# EAGLE design PC2CAN (EAGLE 6.6.0)

## Sheet 1 of 2: MCU
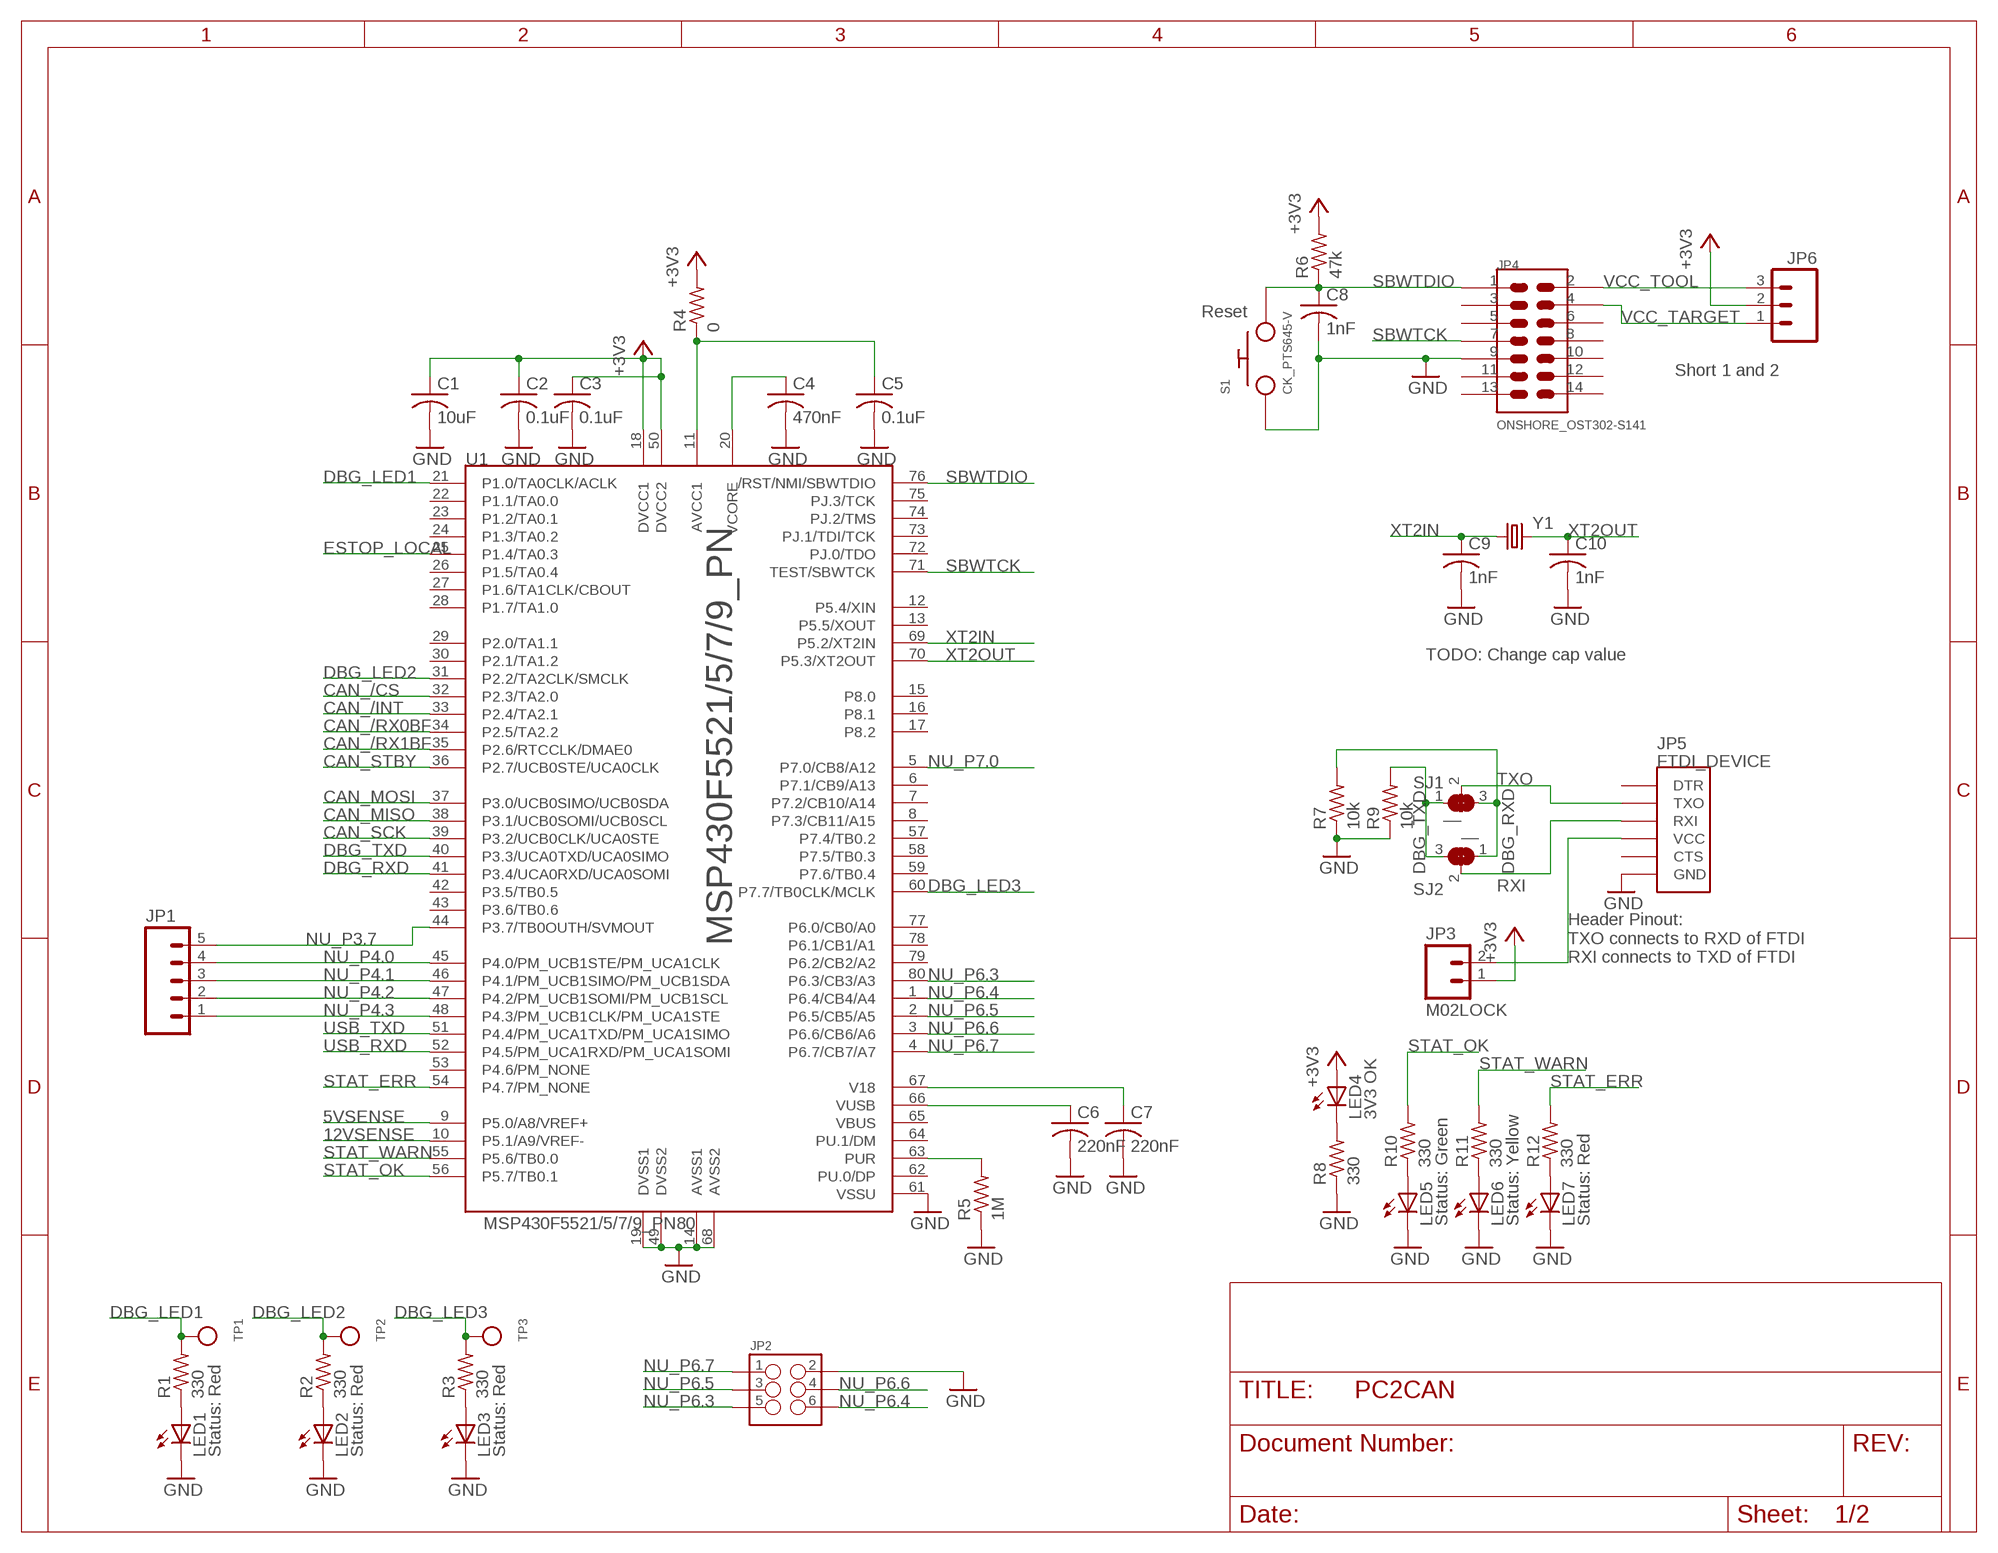
[diagram p0: schematic, sheet 1]

### Parts
C1  10uF  C-USC0805  [C0805]
C2  0.1uF  C-USC0603  [C0603]
C3  0.1uF  C-USC0603  [C0603]
C4  470nF  C-USC0603  [C0603]
C5  0.1uF  C-USC0603  [C0603]
C6  220nF  C-USC0603  [C0603]
C7  220nF  C-USC0603  [C0603]
C8  1nF  C-USC0603  [C0603]
C9  1nF  C-USC0603  [C0603]
C10  1nF  C-USC0603  [C0603]
JP1  M05PTH  [1X05]
JP2  M03X22X3_SILK_SM  [2X3]
JP3  M02LOCK  [1X02_LOCK]
JP4  ONSHORE_OST302-S141  [ONSHORE_OST302-S141]
JP5  FTDI_DEVICE  [FTDI_DEVICE_SIDE]
JP6  M03LOCK  [1X03_LOCK]
LED1  Status: Red  LED0603  [LED-0603]
LED2  Status: Red  LED0603  [LED-0603]
LED3  Status: Red  LED0603  [LED-0603]
LED4  3V3 OK  LED0603  [LED-0603]
LED5  Status: Green  LED0603  [LED-0603]
LED6  Status: Yellow  LED0603  [LED-0603]
LED7  Status: Red  LED0603  [LED-0603]
R1  330  R-US_R0603  [R0603]
R2  330  R-US_R0603  [R0603]
R3  330  R-US_R0603  [R0603]
R4  0  R-US_R0603  [R0603]
R5  1M  R-US_R0603  [R0603]
R6  47k  R-US_R0603  [R0603]
R7  10k  R-US_R0603  [R0603]
R8  330  R-US_R0603  [R0603]
R9  10k  R-US_R0603  [R0603]
R10  330  R-US_R0603  [R0603]
R11  330  R-US_R0603  [R0603]
R12  330  R-US_R0603  [R0603]
S1  CK_PTS645-V  [CK_PTS645-V]
SJ1  SOLDERJUMPER_2WAY0603  [SOLDERJUMPER_2WAY_OPEN_0603]
SJ2  SOLDERJUMPER_2WAY0603  [SOLDERJUMPER_2WAY_OPEN_0603]
TP1  TESTPOINT0.1"  [1X01_ROUND]
TP2  TESTPOINT0.1"  [1X01_ROUND]
TP3  TESTPOINT0.1"  [1X01_ROUND]
U1  MSP430F5521/5/7/9_PN80  [PN80]
Y1  CRYSTALHC49UV  [HC49U-V]

### Nets
5VSENSE: U1.9(P5.0/A8/VREF+) ; also sheet 2
12VSENSE: U1.10(P5.1/A9/VREF-) ; also sheet 2
+3V3: C1.1 C2.1 C3.1 JP3.1 JP6.2 LED4.A R4.2 R6.2 U1.18(DVCC1) U1.50(DVCC2) ; also sheet 2
AVCC: C5.1 R4.1 U1.11(AVCC1)
CAN_/CS: U1.32(P2.3/TA2.0) ; also sheet 2
CAN_/INT: U1.33(P2.4/TA2.1) ; also sheet 2
CAN_/RX0BF: U1.34(P2.5/TA2.2) ; also sheet 2
CAN_/RX1BF: U1.35(P2.6/RTCCLK/DMAE0) ; also sheet 2
CAN_MISO: U1.38(P3.1/UCB0SOMI/UCB0SCL) ; also sheet 2
CAN_MOSI: U1.37(P3.0/UCB0SIMO/UCB0SDA) ; also sheet 2
CAN_SCK: U1.39(P3.2/UCB0CLK/UCA0STE) ; also sheet 2
CAN_STBY: U1.36(P2.7/UCB0STE/UCA0CLK) ; also sheet 2
DBG_LED1: R1.2 TP1.1 U1.21(P1.0/TA0CLK/ACLK)
DBG_LED2: R2.2 TP2.1 U1.31(P2.2/TA2CLK/SMCLK)
DBG_LED3: R3.2 TP3.1 U1.60(P7.7/TB0CLK/MCLK)
DBG_RXD: R7.2 SJ1.3 SJ2.1 U1.41(P3.4/UCA0RXD/UCA0SOMI)
DBG_TXD: R9.2 SJ1.1 SJ2.3 U1.40(P3.3/UCA0TXD/UCA0SIMO)
ESTOP_LOCAL: U1.25(P1.4/TA0.3) ; also sheet 2
GND: C1.2 C2.2 C3.2 C4.2 C5.2 C6.2 C7.2 C8.2 C9.2 C10.2 JP2.2 JP4.9 JP5.P$6(GND) LED1.C LED2.C LED3.C LED5.C LED6.C LED7.C R5.1 R7.1 R8.1 R9.1 S1.1 U1.14(AVSS1) U1.19(DVSS1) U1.49(DVSS2) U1.61(VSSU) U1.68(AVSS2) ; also sheet 2
N$1: JP3.2 JP5.P$4(VCC)
N$2: LED4.C R8.2
N$3: LED5.A R10.1
N$4: LED6.A R11.1
N$5: LED7.A R12.1
N$6: LED1.A R1.1
N$7: R5.2 U1.63(PUR)
N$8: LED2.A R2.1
N$36: LED3.A R3.1
NU_P3.7: JP1.5 U1.44(P3.7/TB0OUTH/SVMOUT)
NU_P4.0: JP1.4 U1.45(P4.0/PM_UCB1STE/PM_UCA1CLK)
NU_P4.1: JP1.3 U1.46(P4.1/PM_UCB1SIMO/PM_UCB1SDA)
NU_P4.2: JP1.2 U1.47(P4.2/PM_UCB1SOMI/PM_UCB1SCL)
NU_P4.3: JP1.1 U1.48(P4.3/PM_UCB1CLK/PM_UCA1STE)
NU_P6.3: JP2.5 U1.80(P6.3/CB3/A3)
NU_P6.4: JP2.6 U1.1(P6.4/CB4/A4)
NU_P6.5: JP2.3 U1.2(P6.5/CB5/A5)
NU_P6.6: JP2.4 U1.3(P6.6/CB6/A6)
NU_P6.7: JP2.1 U1.4(P6.7/CB7/A7)
NU_P7.0: U1.5(P7.0/CB8/A12)
RXI: JP5.P$3(RXI) SJ2.2
SBWTCK: JP4.7 U1.71(TEST/SBWTCK)
SBWTDIO: C8.1 JP4.1 R6.1 S1.2 U1.76(/RST/NMI/SBWTDIO)
STAT_ERR: R12.2 U1.54(P4.7/PM_NONE)
STAT_OK: R10.2 U1.56(P5.7/TB0.1)
STAT_WARN: R11.2 U1.55(P5.6/TB0.0)
TXO: JP5.P$2(TXO) SJ1.2
USB_RXD: U1.52(P4.5/PM_UCA1RXD/PM_UCA1SOMI) ; also sheet 2
USB_TXD: U1.51(P4.4/PM_UCA1TXD/PM_UCA1SIMO) ; also sheet 2
V18: C7.1 U1.67(V18)
VCC_TARGET: JP4.4 JP6.1
VCC_TOOL: JP4.2 JP6.3
VCORE: C4.1 U1.20(VCORE)
VUSB: C6.1 U1.66(VUSB)
XT2IN: C9.1 U1.69(P5.2/XT2IN) Y1.1
XT2OUT: C10.1 U1.70(P5.3/XT2OUT) Y1.2
Unconnected: JP4.3 JP4.5 JP4.6 JP4.8 JP4.10 JP4.11 JP4.12 JP4.13 JP4.14 JP5.P$1(DTR) JP5.P$5(CTS) U1.6(P7.1/CB9/A13) U1.7(P7.2/CB10/A14) U1.8(P7.3/CB11/A15) U1.12(P5.4/XIN) U1.13(P5.5/XOUT) U1.15(P8.0) U1.16(P8.1) U1.17(P8.2) U1.22(P1.1/TA0.0) U1.23(P1.2/TA0.1) U1.24(P1.3/TA0.2) U1.26(P1.5/TA0.4) U1.27(P1.6/TA1CLK/CBOUT) U1.28(P1.7/TA1.0) U1.29(P2.0/TA1.1) U1.30(P2.1/TA1.2) U1.42(P3.5/TB0.5) U1.43(P3.6/TB0.6) U1.53(P4.6/PM_NONE) U1.57(P7.4/TB0.2) U1.58(P7.5/TB0.3) U1.59(P7.6/TB0.4) U1.62(PU.0/DP) U1.64(PU.1/DM) U1.65(VBUS) U1.72(PJ.0/TDO) U1.73(PJ.1/TDI/TCK) U1.74(PJ.2/TMS) U1.75(PJ.3/TCK) U1.77(P6.0/CB0/A0) U1.78(P6.1/CB1/A1) U1.79(P6.2/CB2/A2)

### Notes on the sheet
- Reset
- Short 1 and 2
- TODO: Change cap value
- Header Pinout:
  TXO connects to RXD of FTDI
  RXI connects to TXD of FTDI

## Sheet 2 of 2: External
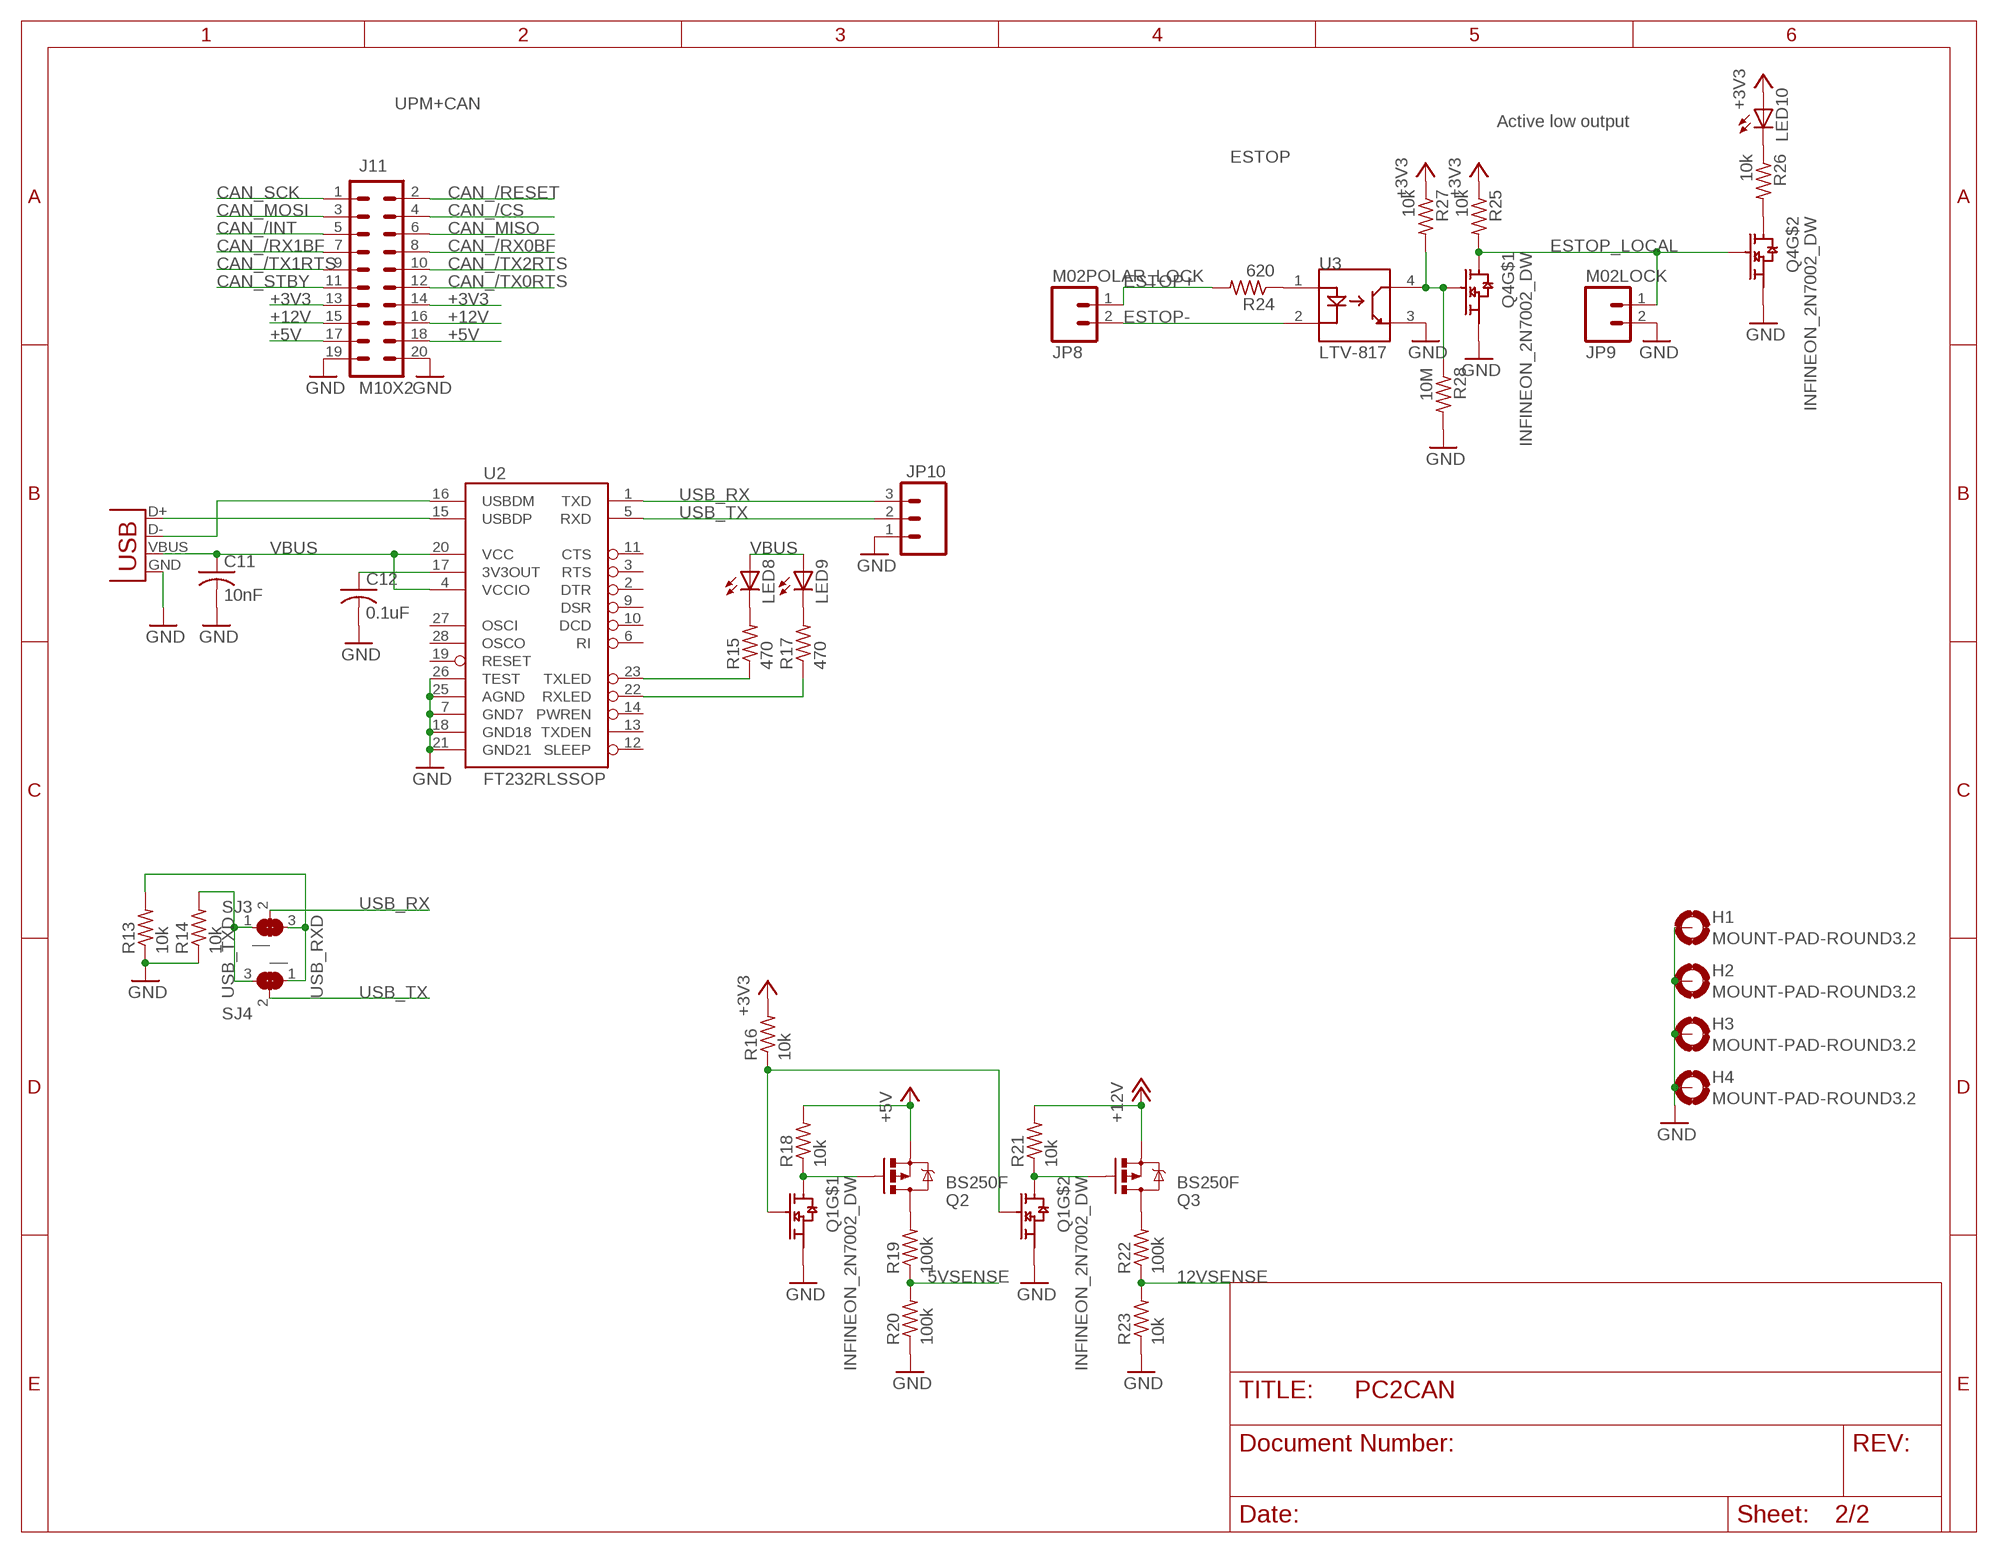
[diagram p1: schematic, sheet 2]

### Parts
C11  10nF  C-USC0603  [C0603]
C12  0.1uF  C-USC0603  [C0603]
H1  MOUNT-PAD-ROUND3.2  [3,2-PAD]
H2  MOUNT-PAD-ROUND3.2  [3,2-PAD]
H3  MOUNT-PAD-ROUND3.2  [3,2-PAD]
H4  MOUNT-PAD-ROUND3.2  [3,2-PAD]
J11  M10X2  [2X10]
JP7  USB-B  USBPTH  [USB-B-PTH]
JP8  M02POLAR_LOCK  [MOLEX-1X2_LOCK]
JP9  M02LOCK  [1X02_LOCK]
JP10  M03LOCK  [1X03_LOCK]
LED8  LED0603  [LED-0603]
LED9  LED0603  [LED-0603]
LED10  LED0603  [LED-0603]
Q1  INFINEON_2N7002_DW  [INFINEON_SOT363]
Q2  BS250F  MOSFET-PCHANNELSMD  [SOT23-3]
Q3  BS250F  MOSFET-PCHANNELSMD  [SOT23-3]
Q4  INFINEON_2N7002_DW  [INFINEON_SOT363]
R13  10k  R-US_R0603  [R0603]
R14  10k  R-US_R0603  [R0603]
R15  470  R-US_R0603  [R0603]
R16  10k  R-US_R0603  [R0603]
R17  470  R-US_R0603  [R0603]
R18  10k  R-US_R0603  [R0603]
R19  100k  R-US_R0603  [R0603]
R20  100k  R-US_R0603  [R0603]
R21  10k  R-US_R0603  [R0603]
R22  100k  R-US_R0603  [R0603]
R23  10k  R-US_R0603  [R0603]
R24  620  R-US_R0603  [R0603]
R25  10k  R-US_R0603  [R0603]
R26  10k  R-US_R0603  [R0603]
R27  10k  R-US_R0603  [R0603]
R28  10M  R-US_R0603  [R0603]
SJ3  SOLDERJUMPER_2WAY0603  [SOLDERJUMPER_2WAY_OPEN_0603]
SJ4  SOLDERJUMPER_2WAY0603  [SOLDERJUMPER_2WAY_OPEN_0603]
U2  FT232RLSSOP  [SSOP28DB]
U3  LTV-817  [LITEON_DIL04_.3]

### Nets
5VSENSE: R19.1 R20.2 ; also sheet 1
12VSENSE: R22.1 R23.2 ; also sheet 1
+3V3: J11.13 J11.14 LED10.A R16.2 R25.1 R27.1 ; also sheet 1
+5V: J11.17 J11.18 Q2.2(S) R18.2
+12V: J11.15 J11.16 Q3.2(S) R21.2
CAN_/CS: J11.4 ; also sheet 1
CAN_/INT: J11.5 ; also sheet 1
CAN_/RESET: J11.2
CAN_/RX0BF: J11.8 ; also sheet 1
CAN_/RX1BF: J11.7 ; also sheet 1
CAN_/TX0RTS: J11.12
CAN_/TX1RTS: J11.9
CAN_/TX2RTS: J11.10
CAN_MISO: J11.6 ; also sheet 1
CAN_MOSI: J11.3 ; also sheet 1
CAN_SCK: J11.1 ; also sheet 1
CAN_STBY: J11.11 ; also sheet 1
ESTOP+: JP8.1 R24.2
ESTOP-: JP8.2 U3.2
ESTOP_LOCAL: JP9.1 Q4.5(GATE) Q4.6(DRAIN) R25.2 ; also sheet 1
ESTOP_LOCAL_INV: Q4.2(GATE) R27.2 R28.1 U3.4
GND: C11.2 C12.2 H1.B3,2(MOUNT) H2.B3,2(MOUNT) H3.B3,2(MOUNT) H4.B3,2(MOUNT) J11.19 J11.20 JP7.GND JP9.2 JP10.1 Q1.1(SOURCE) Q1.4(SOURCE) Q4.1(SOURCE) Q4.4(SOURCE) R13.1 R14.1 R20.1 R23.1 R28.2 U2.7(GND7) U2.18(GND18) U2.21(GND21) U2.25(AGND) U2.26(TEST) U3.3 ; also sheet 1
N$9: Q2.3(D) R19.2
N$10: Q1.6(DRAIN) Q2.1(G) R18.1
N$11: Q3.3(D) R22.2
N$12: Q1.2(GATE) Q1.5(GATE) R16.1
N$13: R24.1 U3.1
N$14: JP7.D+ U2.15(USBDP)
N$15: JP7.D- U2.16(USBDM)
N$16: LED8.C R15.2
N$17: LED9.C R17.2
N$18: R15.1 U2.23(TXLED)
N$19: R17.1 U2.22(RXLED)
N$20: C12.1 U2.17(3V3OUT)
N$21: Q4.3(DRAIN) R26.2
N$22: LED10.C R26.1
USB_RX: JP10.3 SJ3.2 U2.1(TXD)
USB_RXD: R13.2 SJ3.3 SJ4.1 ; also sheet 1
USB_TX: JP10.2 SJ4.2 U2.5(RXD)
USB_TXD: R14.2 SJ3.1 SJ4.3 ; also sheet 1
VBUS: C11.1 JP7.VBUS LED8.A LED9.A U2.4(VCCIO) U2.20(VCC)
VTAP_EN: Q1.3(DRAIN) Q3.1(G) R21.1
Unconnected: U2.2(DTR) U2.3(RTS) U2.6(RI) U2.9(DSR) U2.10(DCD) U2.11(CTS) U2.12(SLEEP) U2.13(TXDEN) U2.14(PWREN) U2.19(RESET) U2.27(OSCI) U2.28(OSCO)

### Notes on the sheet
- UPM+CAN
- Active low output
- ESTOP

## Library data of the parts
C1-C12 = rcl:C-US: CAPACITOR, American symbol
H1-H4 = holes:MOUNT-PAD-ROUND: MOUNTING PAD, round
J11 = SparkFun-Connectors:M10X2: This was SPECIALLY designed to be used with our Graphic LCD Backpack. Be sure you want to use this! It is not only staggered on each line of header holes, but IT IS ALSO offset of the center point of the top and bottom lines by 5 mil. This causes the headers to lock into place on the "standard" footprint on the LCD screen. The extra squares on the tdocu layer are there simply to reference other pins (if you were to actually populate a longer header than ten long - this is what we do with the backpacks).
JP1 = SparkFun-Connectors:M05: Header 5 Standard 5-pin 0.1" header. Use with straight break away headers (SKU : PRT-00116), right angle break away headers (PRT-00553), swiss pins (PRT-00743), machine pins (PRT-00117), and female headers (PRT-00115). Molex polarized connector foot print use with SKU : PRT-08230 with associated crimp pins and housings.
JP2 = SparkFun-Connectors:M03X2: 2x3 .1" header. Shrouded, with keying- CONN-10681 SMT- CONN-11415 Pogo pins- HW-11044
JP3 JP8 JP9 = SparkFun-Connectors:M02: Standard 2-pin 0.1" header. Use with - straight break away headers ( PRT-00116) - right angle break away headers (PRT-00553) - swiss pins (PRT-00743) - machine pins (PRT-00117) - female headers (PRT-00115) Molex polarized connector foot print use with: PRT-08233 with associated crimp pins and housings. 2.54_SCREWTERM for use with PRT-10571. 3.5mm Screw Terminal footprints for PRT-08084 5mm Screw Terminal footprints for use with PRT-08433
JP4 = npol-connectors:ONSHORE_OST302-S141
JP5 = SparkFun-Connectors:FTDI_DEVICE: Connector which mates to FTDI basic or FTDI cable.
JP6 JP10 = SparkFun-Connectors:M03: Header 3 Standard 3-pin 0.1" header. Use with straight break away headers (SKU : PRT-00116), right angle break away headers (PRT-00553), swiss pins (PRT-00743), machine pins (PRT-00117), and female headers (PRT-00115). Molex polarized connector foot print use with SKU : PRT-08232 with associated crimp pins and housings.
JP7 = SparkFun-Connectors:USB: USB Connectors USB-B-PTH is fully proven SKU : PRT-00139/CONN-08278 USB-miniB is fully proven SKU : PRT-00587 USB-A-PCB is untested. USB-A-H is throughly reviewed, but untested. Spark Fun Electronics SKU : PRT-00437 USB-B-SMT is throughly reviewed, but untested. Needs silkscreen touching up. USB-A-S has not been used/tested USB-MB-H has not been used/tested USB-MICROB has been used. CONN-09505; PROD_ID: CONN-08278
LED1-LED10 = SparkFun-LED:LED: LEDs Standard schematic elements and footprints for 5mm, 3mm, 1206, and 0603 sized LEDs. 5mm - Spark Fun Electronics SKU : COM-00529 (and others)
Q1 Q4 = npol-discrete:INFINEON_2N7002_DW
Q2 Q3 = SparkFun-DiscreteSemi:MOSFET-PCHANNEL: Generic PMOSFET
R1-R28 = rcl:R-US_: RESISTOR, American symbol
S1 = npol-electromechanical:CK_PTS645-V
SJ1-SJ4 = microbuilder:SOLDERJUMPER_2WAY: 2-Way Solder Jumper
TP1-TP3 = microbuilder:TESTPOINT: Test Point Various test points for characterisation and PCB testing TESTPOINT_SMT - Compact Surface Mount Test Point [Digikey: 5016KTR-ND]; BOM: EXCLUDE
U1 = npol-msp430:MSP430F5521/5/7/9_PN80
U2 = SparkFun-DigitalIC:FT232RL: USB UART FT232RL 4th Generation USB UART (USB <-> Serial) Controller. Spark Fun Electronics SKU : COM-00650 Production SKU IC-00870; PROD_ID: IC-00870
U3 = npol-digital:LTV-817
Y1 = SparkFun-FreqCtrl:CRYSTAL: Various standard crystals. Proven footprints. Spark Fun Electronics SKU : COM-00534

## Board
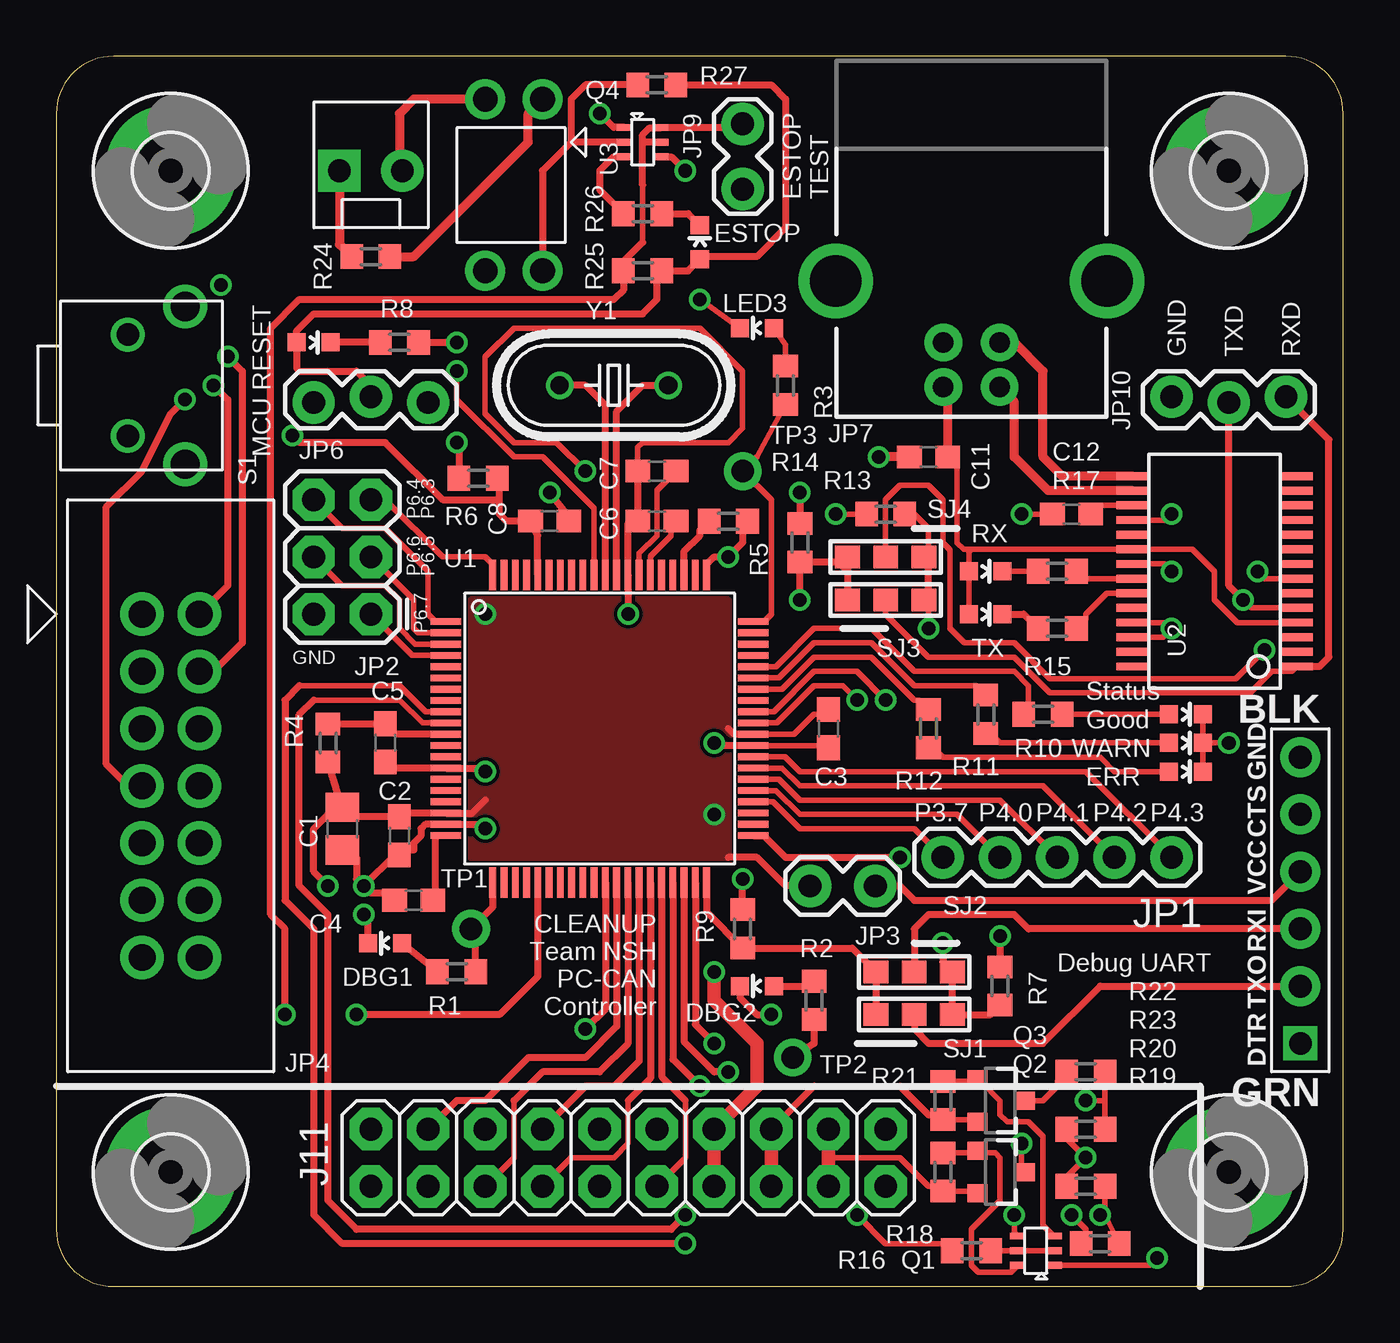
[diagram p2: board, top side]
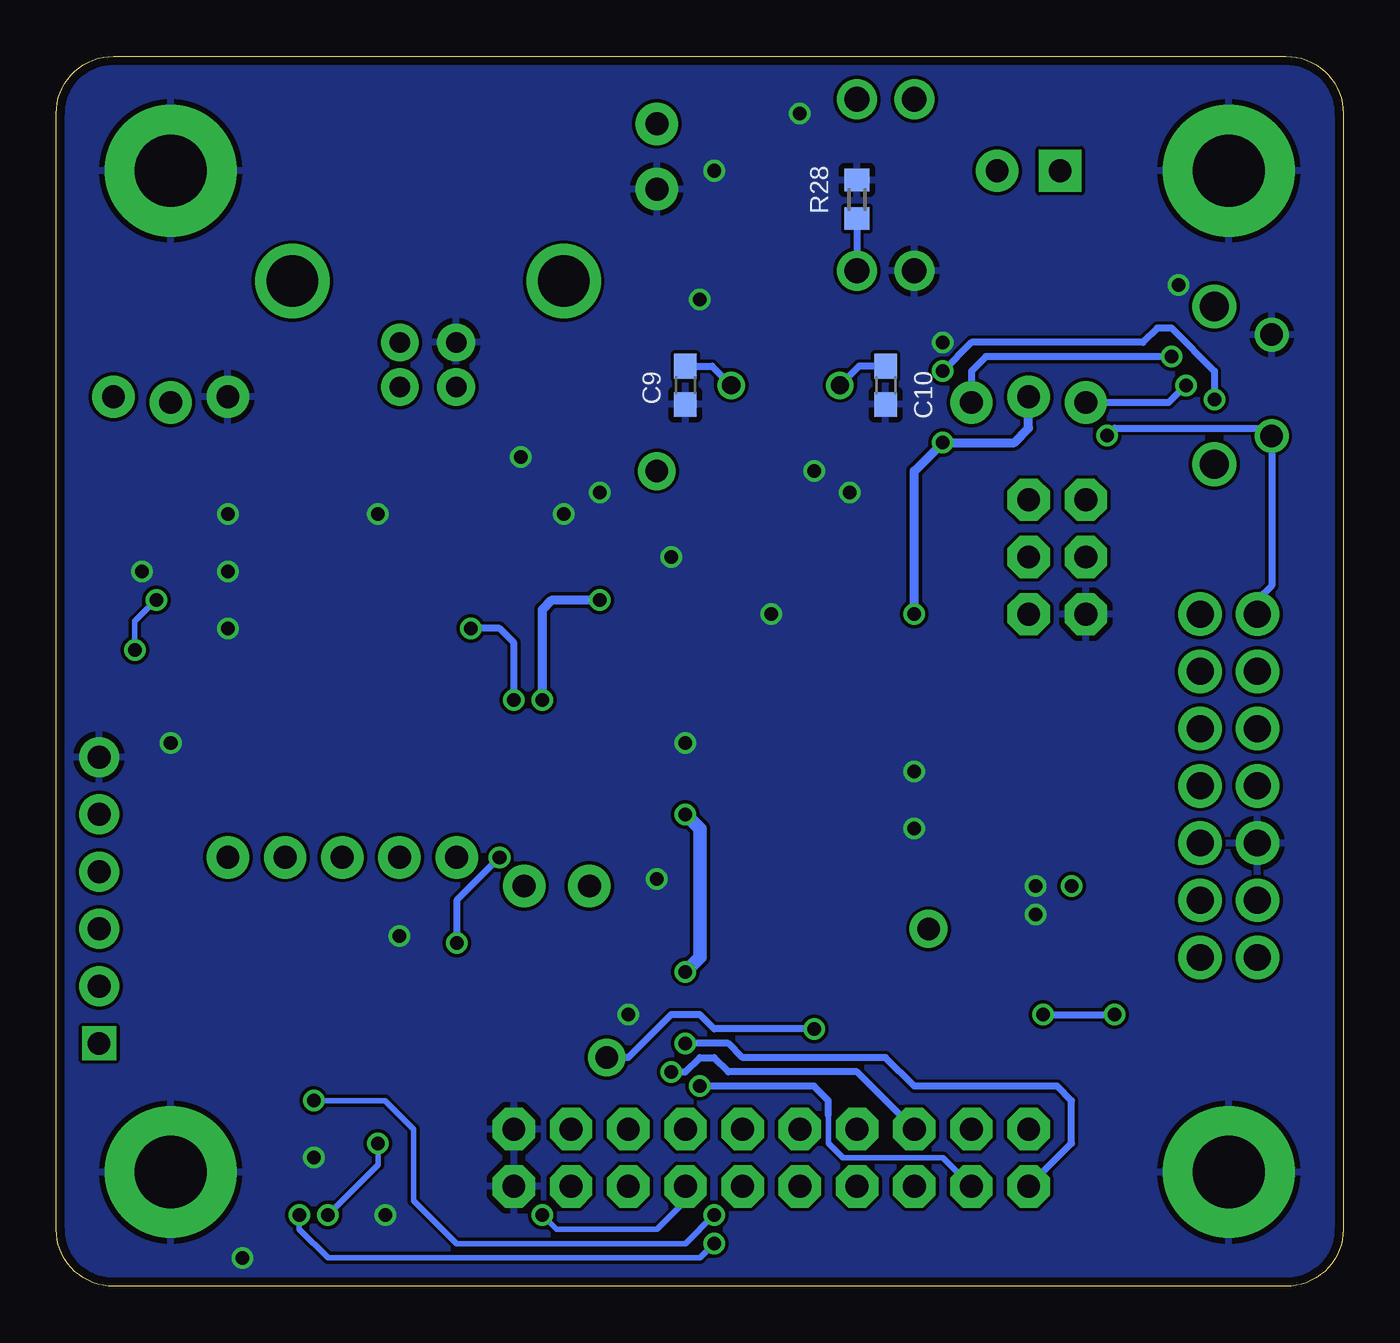
[diagram p3: board, bottom side, seen from below]

Size 57.15 x 54.61 mm. Coordinates in mm from the lower left corner, seen from the top.
Outline: 57.15,2.54 57.15,52.07 arc90 54.61,54.61 2.54,54.61 arc90 0,52.07 0,2.54 arc90 2.54,0 54.61,0 arc90 57.15,2.54
Copper layers (1*16): Top 0.0356mm / dielectric 1.5011mm / Bottom 0.0356mm
Design rules "OshPark": minimum track width 6mil, minimum drill 13mil, track to track 6mil, track to pad 6mil, pad to pad 6mil, via to via 6mil, smd to smd 6mil, copper to edge 15mil, drill to drill 6mil, minimum pad ring 7mil, minimum via ring 7mil, stop-mask expansion 4mil, vias tented up to drill 0mil, thermal gap 10mil

### Footprints (pad centres in the part's own frame; a part is rotated, then mirrored left to right if it is on the bottom)
C0805 = smd 1.3 x 1.5: 1 -0.95,0; 2 0.95,0
C0603 = smd 1.1 x 1: 1 -0.85,0; 2 0.85,0
3,2-PAD = drill 3.2 pad 5.842: B3,2 0,0
2X10 = drill 1.016 pad 1.88 octagon: 1 -11.43,-1.27; 2 -11.43,1.27; 3 -8.89,-1.27; 4 -8.89,1.27; 5 -6.35,-1.27; 6 -6.35,1.27; 7 -3.81,-1.27; 8 -3.81,1.27; 9 -1.27,-1.27; 10 -1.27,1.27; 11 1.27,-1.27; 12 1.27,1.27; 13 3.81,-1.27; 14 3.81,1.27; 15 6.35,-1.27; 16 6.35,1.27; 17 8.89,-1.27; 18 8.89,1.27; 19 11.43,-1.27; 20 11.43,1.27
1X05 = drill 1.016 pad 1.88: 1 0,0; 2 2.54,0; 3 5.08,0; 4 7.62,0; 5 10.16,0
2X3 = drill 1.016 pad 1.88 octagon: 1 0,0; 2 0,2.54; 3 2.54,0; 4 2.54,2.54; 5 5.08,0; 6 5.08,2.54
1X02_LOCK = drill 1.016 pad 1.88: 1 -0.178,0; 2 2.718,0
ONSHORE_OST302-S141 = drill 1.194 pad 1.93: 1 -7.62,-1.27; 2 -7.62,1.27; 3 -5.08,-1.27; 4 -5.08,1.27; 5 -2.54,-1.27; 6 -2.54,1.27; 7 0,-1.27; 8 0,1.27; 9 2.54,-1.27; 10 2.54,1.27; 11 5.08,-1.27; 12 5.08,1.27; 13 7.62,-1.27; 14 7.62,1.27
FTDI_DEVICE_SIDE = drill 1 square: P$1 -6.35,0 | drill 1.016 pad 1.778: P$2 -3.81,0; P$3 -1.27,0; P$4 1.27,0; P$5 3.81,0; P$6 6.35,0
1X03_LOCK = drill 1.016 pad 1.88: 1 0,0.127; 2 2.54,-0.127; 3 5.08,0.127
USB-B-PTH = drill 0.914 pad 1.676: D+ 0,1.25; D- 1.981,1.25; GND 0,-1.25; VBUS 1.981,-1.25 | drill 2.286: S1 -2.718,-6.02; S2 -2.718,6.02
MOLEX-1X2_LOCK = drill 1.016 pad 1.88 square: 1 -0.127,0 | drill 1.016 pad 1.88: 2 2.667,0
LED-0603 = smd 0.8 x 0.8: A 0,-0.75; C 0,0.75
INFINEON_SOT363 = smd 0.3 x 0.7: 1 -0.65,-0.8; 2 0,-0.8; 3 0.65,-0.8; 4 0.65,0.8; 5 0,0.8; 6 -0.65,0.8
SOT23-3 = smd 0.8 x 0.9: 1 -0.95,-1; 2 0.95,-1; 3 0,1.1
R0603 = smd 1 x 1.1: 1 -0.85,0; 2 0.85,0
CK_PTS645-V = drill 1: 1 -2.25,0; 2 2.25,0 | drill 1.3: P$2 3.5,2.55; S1 -3.5,2.55
SOLDERJUMPER_2WAY_OPEN_0603 = smd 1.1 x 1: 1 -1.7,0; 2 0,0; 3 1.7,0
1X01_ROUND = drill 1 pad 1.676: 1 0,0
PN80 = smd 1.35 x 0.3: 1 -6.825,4.75; 2 -6.825,4.25; 3 -6.825,3.75; 4 -6.825,3.25; 5 -6.825,2.75; 6 -6.825,2.25; 7 -6.825,1.75; 8 -6.825,1.25; 9 -6.825,0.75; 10 -6.825,0.25; 11 -6.825,-0.25; 12 -6.825,-0.75; 13 -6.825,-1.25; 14 -6.825,-1.75; 15 -6.825,-2.25; 16 -6.825,-2.75; 17 -6.825,-3.25; 18 -6.825,-3.75; 19 -6.825,-4.25; 20 -6.825,-4.75; 41 6.825,-4.75; 42 6.825,-4.25; 43 6.825,-3.75; 44 6.825,-3.25; 45 6.825,-2.75; 46 6.825,-2.25; 47 6.825,-1.75; 48 6.825,-1.25; 49 6.825,-0.75; 50 6.825,-0.25; 51 6.825,0.25; 52 6.825,0.75; 53 6.825,1.25; 54 6.825,1.75; 55 6.825,2.25; 56 6.825,2.75; 57 6.825,3.25; 58 6.825,3.75; 59 6.825,4.25; 60 6.825,4.75 | smd 0.3 x 1.35: 21 -4.75,-6.825; 22 -4.25,-6.825; 23 -3.75,-6.825; 24 -3.25,-6.825; 25 -2.75,-6.825; 26 -2.25,-6.825; 27 -1.75,-6.825; 28 -1.25,-6.825; 29 -0.75,-6.825; 30 -0.25,-6.825; 31 0.25,-6.825; 32 0.75,-6.825; 33 1.25,-6.825; 34 1.75,-6.825; 35 2.25,-6.825; 36 2.75,-6.825; 37 3.25,-6.825; 38 3.75,-6.825; 39 4.25,-6.825; 40 4.75,-6.825; 61 4.75,6.825; 62 4.25,6.825; 63 3.75,6.825; 64 3.25,6.825; 65 2.75,6.825; 66 2.25,6.825; 67 1.75,6.825; 68 1.25,6.825; 69 0.75,6.825; 70 0.25,6.825; 71 -0.25,6.825; 72 -0.75,6.825; 73 -1.25,6.825; 74 -1.75,6.825; 75 -2.25,6.825; 76 -2.75,6.825; 77 -3.25,6.825; 78 -3.75,6.825; 79 -4.25,6.825; 80 -4.75,6.825
SSOP28DB = smd 0.348 x 1.397: 1 -4.225,-3.656; 2 -3.575,-3.656; 3 -2.925,-3.656; 4 -2.275,-3.656; 5 -1.625,-3.656; 6 -0.975,-3.656; 7 -0.325,-3.656; 8 0.325,-3.656; 9 0.975,-3.656; 10 1.625,-3.656; 11 2.275,-3.656; 12 2.925,-3.656; 13 3.575,-3.656; 14 4.225,-3.656; 15 4.225,3.656; 16 3.575,3.656; 17 2.925,3.656; 18 2.275,3.656; 19 1.625,3.656; 20 0.975,3.656; 21 0.325,3.656; 22 -0.325,3.656; 23 -0.975,3.656; 24 -1.625,3.656; 25 -2.275,3.656; 26 -2.925,3.656; 27 -3.575,3.656; 28 -4.225,3.656
LITEON_DIL04_.3 = drill 1.1 pad 1.778: 1 -3.81,1.27; 2 -3.81,-1.27; 3 3.81,-1.27; 4 3.81,1.27
HC49U-V = drill 0.813: 1 -2.413,0; 2 2.413,0

### Placement (x,y rotation side)
C1  12.7,20.32 270 top
C2  15.24,20 270 top
C3  34.29,24.77 270 top
C4  15.88,17.14 180 top
C5  14.61,24.13 270 top
C6  26.67,33.97 180 top
C7  26.67,36.2 180 top
C8  21.91,33.97 0 top
C9  29.21,40.01 270 bottom
C10  20.32,40.01 270 bottom
C11  38.73,36.83 180 top
C12  45.09,34.29 180 top
H1  5.08,5.08 0 top
H2  52.07,5.08 0 top
H3  52.07,49.53 0 top
H4  5.08,49.53 0 top
J11  25.4,5.71 0 top
JP1  49.53,19.05 180 top
JP2  13.97,29.84 90 top
JP3  33.66,17.78 0 top
JP4  5.08,22.23 270 top
JP5  55.24,17.14 90 top
JP6  16.51,39.37 180 top
JP7  40.64,41.91 270 top
JP8  12.7,49.53 0 top
JP9  30.48,51.44 270 top
JP10  49.53,39.37 0 top
LED1  14.61,15.24 90 top
LED2  31.11,13.34 90 top
LED3  31.11,42.55 90 top
LED4  11.43,41.91 270 top
LED5  50.16,25.4 270 top
LED6  50.16,24.13 270 top
LED7  50.16,22.86 270 top
LED8  41.27,29.84 270 top
LED9  41.27,31.75 270 top
LED10  28.57,46.35 0 top
Q1  43.5,1.59 90 top
Q2  41.91,5.08 270 top
Q3  41.91,8.26 270 top
Q4  26.04,50.8 270 top
R1  17.78,13.97 0 top
R2  33.66,12.7 270 top
R3  32.38,40.01 270 top
R4  12.06,24.13 270 top
R5  29.84,33.97 180 top
R6  18.73,35.88 180 top
R7  41.91,13.34 270 top
R8  15.24,41.91 180 top
R9  30.48,15.88 270 top
R10  43.81,25.4 180 top
R11  41.27,25.4 90 top
R12  38.73,24.77 90 top
R13  36.83,34.29 0 top
R14  33.02,33.02 270 top
R15  44.45,29.21 180 top
R16  40.64,1.59 180 top
R17  44.45,31.75 180 top
R18  39.37,5.08 270 top
R19  46.35,1.91 180 top
R20  45.72,4.45 0 top
R21  39.37,8.26 270 top
R22  45.72,9.53 180 top
R23  45.72,6.99 0 top
R24  13.97,45.72 180 top
R25  26.04,45.09 180 top
R26  26.04,47.62 180 top
R27  26.67,53.34 180 top
R28  21.59,48.26 90 bottom
S1  3.17,40.01 270 top
SJ1  38.1,12.06 0 top
SJ2  38.1,13.97 180 top
SJ3  36.83,30.48 0 top
SJ4  36.83,32.38 180 top
TP1  18.41,15.88 0 top
TP2  32.7,10.16 0 top
TP3  30.48,36.2 0 top
U1  24.13,24.77 0 top
U2  51.44,31.75 90 top
U3  20.32,48.9 270 top
Y1  24.77,40.01 180 top

### Tracks (layer width: path | path; a pad name or v marks a point on that pad's centre or on a via)
5VSENSE  (via drill 0.6)
  Top 0.254: U1.9 16.39,25.52 15.24,26.67 10.79,26.67 | R20.2 46.57,3.17 | 46.57,3.17 R19.1 | v46.35,3.17 46.57,3.17
  Top 0.305: v27.94,1.91 12.7,1.91 11.43,3.17 11.43,15.88 10.16,17.14 10.16,26.04 10.79,26.67
  Bottom 0.254: v27.94,1.91 28.57,1.27 45.09,1.27 46.35,2.54 v46.35,3.17
12VSENSE  (via drill 0.6)
  Top 0.254: U1.10 16.26,25.02 15.24,26.04 11.43,26.04 | R22.1 46.57,8.26 | 46.57,8.26 R23.2 | v45.72,8.26 46.57,8.26
  Top 0.305: v27.94,3.17 27.3,2.54 13.34,2.54 12.06,3.81 12.06,16.51 10.79,17.78 10.79,25.4 11.43,26.04
  Bottom 0.254: v45.72,8.26 42.55,8.26 41.27,6.99 41.27,3.81 39.37,1.91 29.21,1.91 v27.94,3.17
+3V3  (via drill 0.6)
  Top 0.254: v35.56,3.17 36.83,1.91 39.47,1.91 R16.2 | U1.50 32.77,24.52 33.66,25.4 34.08,25.4 C3.1
  Top 0.305: C1.1 13.12,20.85 C2.1 15.4,21.02 U1.18 18.48,21.02 19.05,21.59 | C1.1 R4.2 | U1.50 30.09,24.52 29.84,24.77 | v12.06,17.78 11.43,18.41 11.43,20.32 12.06,20.95 12.38,20.95 C1.1 | v17.78,37.47 17.88,37.15 R6.2 | JP3.1 32.38,17.78 31.11,19.05 29.84,19.05 | JP6.2 13.97,40.01 13.34,40.64 10.79,40.64 10.68,40.76 LED4.A 10.68,42.43 11.43,43.18 26.04,43.18 26.67,43.81 26.67,44.87 R25.1 28.05,45.09 LED10.A 28.69,45.72 31.11,45.72 32.38,46.99 32.38,52.7 31.75,53.34 R27.1
  Top 0.61: J11.13 J11.14 31.11,8.89 31.11,10.79 29.21,12.7 v29.21,13.97
  Bottom 0.254: J11.13 29.21,3.81 30.48,2.54 34.92,2.54 v35.56,3.17
  Bottom 0.305: 11.85,17.57 v12.06,17.78
  Bottom 0.406: v19.05,29.84 19.05,36.2 v17.78,37.47 14.61,37.47 13.97,38.1 JP6.2
  Bottom 0.61: v29.21,13.97 28.57,14.61 28.57,20.32 v29.21,20.95
  pour Top: 18.41,30.48 18.41,19.05 29.84,19.05 29.84,30.48
+5V
  Top 0.254: R18.2 40.81,4.23 Q2.2 | R18.2 38.95,4.23 | 34.29,5.71 37.47,5.71 38.73,4.45 39.16,4.45 R18.2
  Top 0.61: J11.17 34.29,5.71 J11.18 34.29,7.16 34.47,7.16
+12V
  Top 0.254: R21.2 40.81,7.41 Q3.2
  Top 0.305: J11.16 33.66,8.89 37.47,8.89 38.73,7.62 39.16,7.62 R21.2
  Top 0.61: J11.16 J11.15 31.75,3.81
AVCC
  Top 0.305: R4.1 C5.1 15.07,24.52 U1.11
CAN_/CS
  Top 0.305: U1.32 24.88,11.54 23.5,10.16 20.95,10.16 19.05,8.26 17.78,8.26 J11.4
CAN_/INT
  Top 0.254: 20.32,8.26 20.32,5.71 J11.5
  Top 0.305: U1.33 25.38,10.78 24.13,9.53 21.59,9.53 20.32,8.26
CAN_/RX0BF
  Top 0.305: U1.34 25.88,10.01 24.77,8.89 23.5,8.89 J11.8
CAN_/RX1BF
  Top 0.254: 25.4,8.26 25.4,6.35 24.77,5.71 22.86,5.71 J11.7
  Top 0.305: U1.35 26.38,9.23 25.4,8.26
CAN_MISO  (via drill 0.6)
  Top 0.305: U1.38 27.88,10.86 29.21,9.53 v29.84,9.53
  Bottom 0.305: J11.6 21.59,9.53 27.3,9.53 27.94,10.16 28.57,10.16 29.21,9.53 v29.84,9.53
CAN_MOSI  (via drill 0.6)
  Top 0.305: U1.37 27.38,10.09 v28.57,8.89
  Bottom 0.254: J11.3 17.78,5.71 22.23,5.71 22.86,6.35 22.86,7.62
  Bottom 0.305: 22.86,7.62 22.86,8.26 23.5,8.89 v28.57,8.89
CAN_SCK  (via drill 0.6)
  Top 0.305: U1.39 28.38,11.62 v29.21,10.79
  Bottom 0.305: J11.1 12.06,6.35 12.06,8.26 12.7,8.89 19.05,8.89 20.32,10.16 26.67,10.16 27.3,10.79 v29.21,10.79
CAN_STBY
  Top 0.254: 27.94,8.26 27.94,5.71 J11.11
  Top 0.305: U1.36 26.88,9.31 27.94,8.26
DBG_LED1
  Top 0.305: R1.2 18.63,15.66 TP1.1 19.38,16.84 U1.21
DBG_LED2  (via drill 0.6)
  Top 0.305: U1.31 24.38,12.31 v23.5,11.43 | R2.2 33.66,10.79 TP2.1
  Bottom 0.305: v23.5,11.43 27.94,11.43 28.57,12.06 29.84,12.06 31.75,10.16 TP2.1
DBG_LED3
  Top 0.254: U1.60 31.42,29.52 31.75,29.84 31.75,34.92 TP3.1 31.11,36.83 R3.2
DBG_RXD  (via drill 0.6)
  Top 0.305: R7.2 41.49,12.06 SJ1.3 SJ2.1 39.37,14.4 v39.37,15.24 | U1.41 31.42,20.02 32.38,19.05 v37.47,19.05
  Bottom 0.305: v37.47,19.05 39.37,17.14 v39.37,15.24
DBG_TXD
  Top 0.305: U1.40 28.88,16.62 R9.2 35.34,15.03 SJ2.3 SJ1.1
ESTOP+
  Top 0.406: JP8.1 12.57,46.27 R24.2
ESTOP-
  Top 0.406: U3.2 15.88,52.7 15.24,52.07 15.24,49.66 JP8.2
ESTOP_LOCAL  (via drill 0.6)
  Top 0.254: 26.04,46.35 26.04,48.9
  Top 0.305: U1.25 21.38,13.76 19.68,12.06 v13.34,12.06 | v10.16,12.06 10.16,15.88 9.53,16.51 9.53,42.55 10.79,43.81 24.77,43.81 25.18,44.23 R25.2 25.18,45.51 26.04,46.35 | 26.04,48.9 26.04,50.8 | 26.04,50.8 26.04,51.12 26.35,51.44 26.82,51.44 Q4.6 30.32,51.45 JP9.1 | Q4.5 26.04,50.8
  Bottom 0.305: v13.34,12.06 v10.16,12.06
ESTOP_LOCAL_INV
  Top 0.305: Q4.2 22.86,50.8 | 22.86,50.8 21.59,49.53 U3.4 | R27.2 23.5,53.34 22.86,52.7 22.86,50.8
  Bottom 0.305: R28.1 U3.4
GND  (via drill 0.6)
  Top 0.254: C7.2 25.82,37.25 26.04,37.47 29.84,37.47 30.48,38.1 30.48,40.64 28.57,42.55 20.32,42.55 19.05,41.27 19.05,38.73 20.32,37.47 22.23,37.47 v23.5,36.2 | R23.1 44.87,6.57 v45.72,5.71 44.87,4.87 R20.1 | Q1.1 48.56,0.94 v48.9,1.27 | v42.55,3.17 42.55,2.39 Q1.4 | LED5.C LED6.C | LED6.C LED7.C | LED6.C v52.07,24.13 | U1.49 34.19,24.02 C3.2 | LED3.C v28.57,43.81 | U2.18 49.16,34.02 v49.53,34.29 | C12.2 v42.86,34.29 | U2.25 49.27,29.48 v49.53,29.21 49.15,28.82 U2.26 | U2.21 49.2,32.08 v49.53,31.75 | R13.1 v34.61,34.29 | U2.7 53.66,31.43 v53.34,31.75
  Top 0.305: C1.2 13.02,19.37 13.34,19.05 13.34,18.1 v13.65,17.78 | v13.65,17.78 15.03,19.15 C2.2 15.46,19.37 15.88,19.37 15.88,19.68 16.19,20 16.19,20.32 16.39,20.52 U1.19 18.86,20.52 v19.05,20.32 | C4.2 14.92,17.14 14.61,17.46 13.97,17.46 v13.65,17.78 | C5.2 14.87,23.02 U1.14 18.89,23.02 v19.05,22.86 | U1.49 29.32,24.02 v29.21,24.13 | v25.4,29.84 25.38,29.86 U1.68 25.38,33.85 C6.2 C7.2 | U1.61 28.88,32.05 29.21,32.38 v29.84,32.38 30.48,33.02 30.48,33.66 30.7,33.87 R5.1 | C8.2 22.76,34.19 v21.91,35.24 | LED1.C 13.86,16.39 v13.65,16.51 | R9.1 v30.48,18.1 | LED2.C 30.36,12.81 31.11,12.06 v31.75,12.06 | v41.91,15.56 R7.1 | v33.02,35.24 R14.1 | R8.1 v17.78,41.91 | Q4.4 27.32,50.15 v27.94,49.53 | Q4.1 24.75,51.45 v24.13,52.07
  Top 0.406: C11.2 v36.51,36.83
  other vias: 7.3,44.45
  pour Bottom: 0,0 0,54.61 57.15,54.61 57.15,0
N$1
  Top 0.305: JP3.2 37.47,17.78 38.1,17.14 53.98,17.14 JP5.P$4
N$2
  Top 0.305: R8.2 LED4.C
N$3
  Top 0.254: R10.1 LED5.A
N$4
  Top 0.254: R11.1 41.49,24.55 41.91,24.13 LED6.A
N$5
  Top 0.254: R12.1 38.95,23.91 39.37,23.5 46.35,23.5 46.99,22.86 LED7.A
N$6
  Top 0.305: LED1.A R1.1
N$7
  Top 0.305: U1.63 27.88,32.64 28.57,33.34 28.57,33.55 R5.2
N$8
  Top 0.305: LED2.A 33.44,13.34 R2.1
N$9  (via drill 0.6)
  Top 0.254: Q2.3 43.01,5.25 42.86,5.4 v42.86,6.35 | v45.09,3.17 45.72,2.54 45.72,2.12 R19.2
  Bottom 0.254: v42.86,6.35 42.86,5.4 v45.09,3.17
N$10
  Top 0.254: R18.1 40.81,5.93 | 40.81,5.93 Q2.1 | 40.81,5.93 41.7,5.93 41.91,5.71 41.91,3.81 40.64,2.54 40.64,0.95 40.96,0.64 42.4,0.64 Q1.6
N$11
  Top 0.254: Q3.3 43.81,8.26 44.45,8.89 44.45,9.11 R22.2
N$12
  Top 0.254: Q1.2 Q1.5 R16.1
N$13
  Top 0.406: R24.1 15.88,45.72 20.95,50.8 20.95,52.07 U3.1
N$14
  Top 0.406: U2.15 44.67,35.98 43.81,36.83 43.81,40.64 42.55,41.91 JP7.D+
N$15
  Top 0.406: U2.16 44.05,35.33 42.55,36.83 42.55,39.27 JP7.D-
N$16
  Top 0.305: LED8.C 42.97,29.84 R15.2
N$17
  Top 0.254: R17.2 LED9.C
N$18
  Top 0.254: U2.23 46.65,30.77 45.72,29.84 45.72,29.63 R15.1
N$19
  Top 0.254: U2.22 45.62,31.43 R17.1
N$20
  Top 0.254: U2.17 46.32,34.67 C12.1
N$21
  Top 0.305: Q4.3 24.75,50.15 24.13,49.53 24.13,48.68 R26.2
N$22
  Top 0.305: R26.1 28.05,47.62 LED10.C
N$36
  Top 0.254: R3.1 32.38,41.8 LED3.A
NU_P3.7
  Top 0.254: U1.44 31.82,21.52 33.02,20.32 38.1,20.32 JP1.5
NU_P4.0
  Top 0.254: U1.45 31.96,22.02 33.02,20.95 40.01,20.95 JP1.4
NU_P4.1
  Top 0.254: U1.46 32.09,22.52 33.02,21.59 41.91,21.59 JP1.3
NU_P4.2
  Top 0.254: U1.47 32.23,23.02 33.02,22.23 43.81,22.23 JP1.2
NU_P4.3
  Top 0.254: U1.48 32.37,23.52 33.02,22.86 45.72,22.86 JP1.1
NU_P6.3
  Top 0.254: U1.80 19.38,32.05 19.05,32.38 17.14,32.38 14.61,34.92 JP2.5
NU_P6.4
  Top 0.254: U1.1 16.84,29.52 16.51,29.84 16.51,31.75 14.61,33.66 12.7,33.66 JP2.6
NU_P6.5
  Top 0.254: U1.2 16.07,29.02 15.88,29.21 15.88,30.48 JP2.3
NU_P6.6
  Top 0.254: U1.3 15.94,28.52 15.24,29.21 15.24,30.48 14.61,31.11 12.7,31.11 JP2.4
NU_P6.7
  Top 0.254: U1.4 15.8,28.02 JP2.1
RXI
  Top 0.305: JP5.P$3 43.18,15.88 42.55,16.51 38.73,16.51 38.1,15.88 SJ2.2
SBWTCK  (via drill 0.6)
  Top 0.254: U1.71 23.88,34.54 21.59,36.83 20.32,36.83 17.78,39.37 v17.78,40.64
  Top 0.305: JP4.7 3.17,22.23 2.22,23.18 2.22,34.61 3.81,36.2 5.08,38.73 v5.71,39.37
  Bottom 0.305: v17.78,40.64 16.51,41.91 8.89,41.91 8.26,42.55 7.62,42.55 5.71,40.64 v5.71,39.37
SBWTDIO  (via drill 0.6)
  Top 0.305: U1.76 21.38,33.33 C8.1 20,33.97 19.68,34.29 19.68,34.92 | 19.68,34.92 19.68,35.77 R6.1 | 19.68,34.92 17.14,34.92 14.61,37.47 10.79,37.47 v10.48,37.78
  Bottom 0.305: v10.48,37.78 10.16,38.1 3.52,38.1 S1.2 3.17,31.11 3.81,30.48 JP4.1
STAT_ERR
  Top 0.254: U1.54 32.23,26.52 33.66,27.94 36.2,27.94 38.1,26.04 38.31,26.04 R12.2
STAT_OK
  Top 0.254: U1.56 31.96,27.52 33.66,29.21 36.2,29.21 38.1,27.3 42.55,27.3 43.18,26.67 43.18,25.61 R10.2
STAT_WARN
  Top 0.254: U1.55 32.09,27.02 33.66,28.57 36.2,28.57 38.1,26.67 40.85,26.67 R11.2
TXO
  Top 0.305: SJ1.2 38.1,11.43 38.73,10.79 43.81,10.79 46.35,13.34 JP5.P$2
USB_RX
  Top 0.254: SJ3.2 36.83,29.84 38.73,27.94 42.55,27.94 44.13,26.35 53.02,26.35 53.98,27.3 54.87,27.3 U2.1
  Top 0.305: U2.1 56.1,27.52 56.52,27.94 56.52,37.59 JP10.3
USB_RXD  (via drill 0.6)
  Top 0.254: U1.52 31.86,25.52 33.66,27.3 35.56,27.3 v36.83,26.04 | R13.2 38.1,34.29 38.73,33.66 38.73,32.59 SJ4.1 | 38.73,30.48 v38.73,29.21
  Top 0.305: 38.74,32.17 SJ4.1 38.73,32.18 38.73,30.48 SJ3.3
  Bottom 0.305: v36.83,26.04 36.83,28.57 37.47,29.21 v38.73,29.21
USB_TX  (via drill 0.6)
  Top 0.254: SJ4.2 36.83,34.92 37.47,35.56 38.73,35.56 39.37,34.92 39.37,33.02 39.69,32.7 39.69,29.21 40.32,28.57 42.55,28.57 44.13,26.99 52.39,26.99 v53.66,28.26 | U2.5 53.06,30.12 v52.7,30.48
  Top 0.305: v52.7,30.48 52.07,31.11 JP10.2
  Bottom 0.254: v53.66,28.26 53.66,29.53 v52.7,30.48
USB_TXD  (via drill 0.6)
  Top 0.254: U1.51 32,25.02 33.66,26.67 34.92,26.67 v35.56,26.04
  Top 0.305: v33.02,30.48 R14.2 34.71,32.17 35.13,31.75 | SJ4.3 35.13,31.75 | 35.13,31.75 SJ3.1
  Bottom 0.406: v35.56,26.04 35.56,30.05 SJ3.1 v33.02,30.48
V18
  Top 0.254: U1.67 25.88,32.55 26.67,33.34 26.67,35.34 C7.1
VBUS
  Top 0.254: U2.4 52.44,29.48 51.44,30.48 51.44,31.75 50.46,32.73 U2.20 40.64,32.73 | LED8.A LED9.A 40.52,32.61 40.64,32.73 | 40.64,32.73 40.3,32.73 40.01,33.02 40.01,36.41 C11.1
  Top 0.406: C11.1 39.59,39.73 JP7.VBUS
VCC_TARGET  (via drill 0.6)
  Top 0.305: JP4.4 6.99,27.3 8.26,28.57 8.26,40.64 v7.62,41.27
  Bottom 0.305: v7.62,41.27 15.88,41.27 16.51,40.64 JP6.1
VCC_TOOL  (via drill 0.6)
  Top 0.305: JP4.2 7.62,31.11 7.62,39.37 v6.99,40.01
  Bottom 0.305: JP6.3 7.75,39.24 v6.99,40.01
VCORE
  Top 0.305: U1.20 16.84,20.02 16.83,20 16.83,17.25 C4.1
VTAP_EN
  Top 0.254: R21.1 40.81,9.11 | 40.81,9.11 Q3.1 | 40.81,9.11 41.06,9.11 41.91,8.26 41.91,7.62 42.23,7.3 43.18,7.3 43.81,6.67 43.81,2.72 Q1.3
VUSB
  Top 0.254: U1.66 26.38,32.41 27.3,33.34 27.3,33.76
  Top 0.305: 27.3,33.76 C6.1
XT2IN
  Top 0.305: U1.69 24.88,38.85 26.04,40.01 Y1.1
  Bottom 0.305: C9.1 28.03,40.85 Y1.1
XT2OUT
  Top 0.305: U1.70 24.38,39.12 23.5,40.01 Y1.2
  Bottom 0.305: C10.1 21.5,40.85 Y1.2

### Text on the board
tNames: ESTOP / TEST | ESTOP | GND | TXD | RXD | MCU RESET | P6.4 | P6.3 | P6.6 | P6.5 | RX | P6.7 | GND | TX | Status | Good | WARN | ERR | P3.7 | P4.0 | P4.1 | P4.2 | P4.3 | CLEANUP / Team NSH / PC-CAN / Controller | Debug UART | DBG1 | DBG2